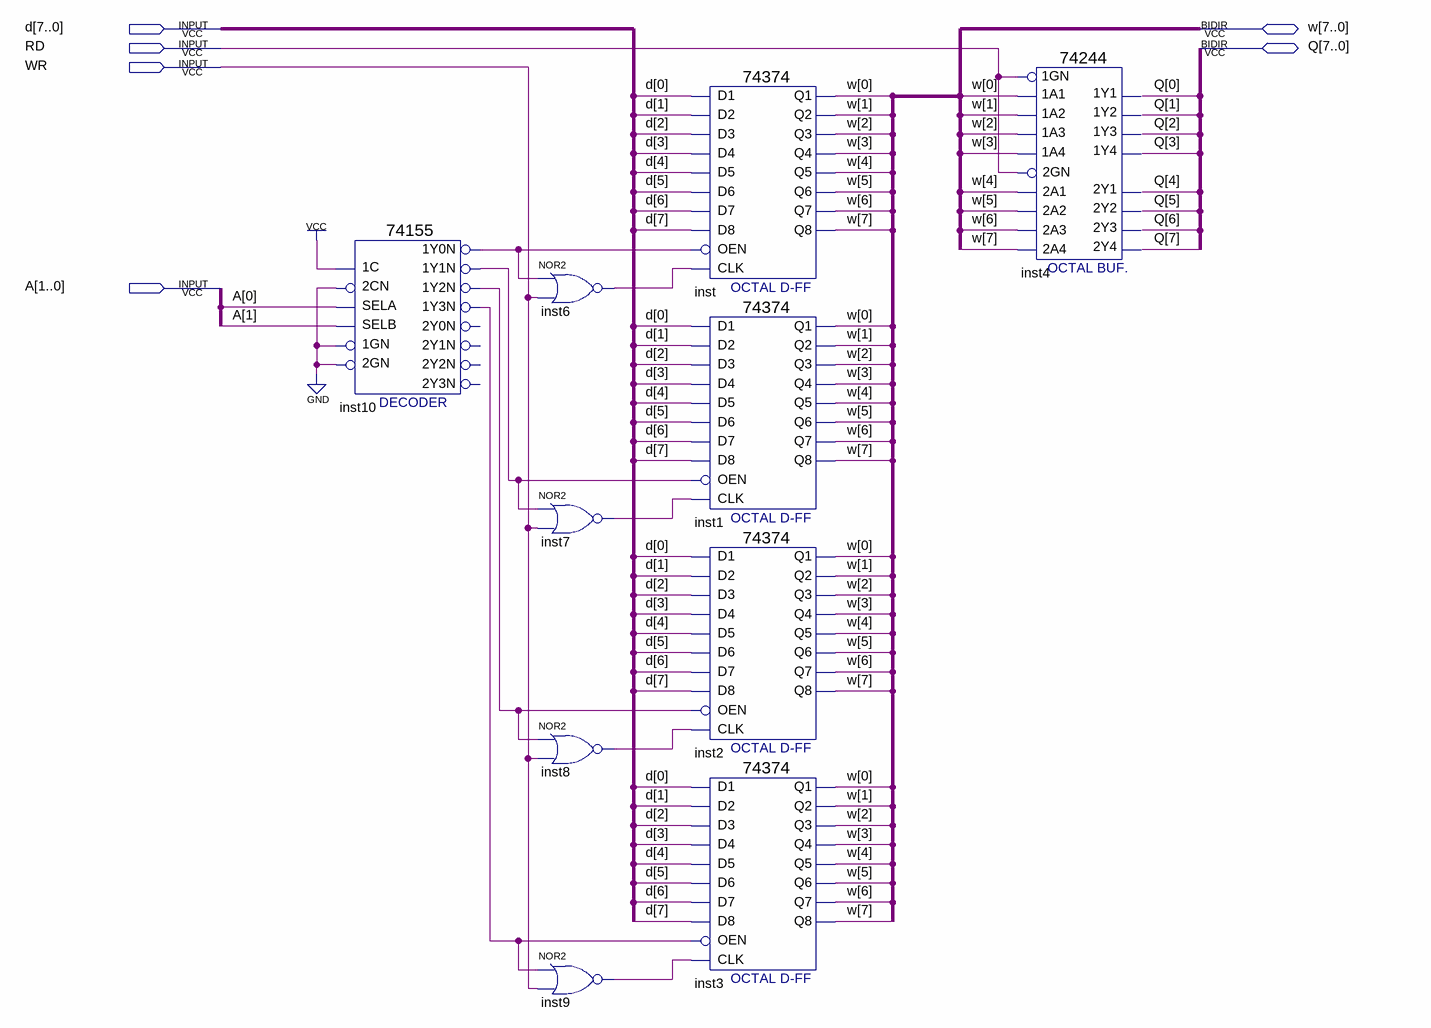
[diagram p0: schematic sheet]
// Quartus schematic mem8b.bdf as structural Verilog: 10 symbols, 6 pins
module mem8b (
  input  [7:0] d,
  input  RD,
  input  WR,
  input  [1:0] A,
  inout  [7:0] w,
  inout  [7:0] Q
);

  wire inst6_out, inst7_out, inst8_out, inst9_out, inst10_1y0n, inst10_1y1n, inst10_1y2n, inst10_1y3n;

  \74155  inst10 (
    .\1C (1'b1), .\2CN (1'b0), .SELB(A[1]), .SELA(A[0]), .\1GN (1'b0), .\2GN (1'b0), .\1Y2N (inst10_1y2n),
    .\1Y1N (inst10_1y1n), .\1Y0N (inst10_1y0n), .\1Y3N (inst10_1y3n));  // open: 2Y1N, 2Y0N, 2Y3N, 2Y2N
  nor inst6 (inst6_out, inst10_1y0n, WR);
  nor inst7 (inst7_out, inst10_1y1n, WR);
  nor inst8 (inst8_out, inst10_1y2n, WR);
  nor inst9 (inst9_out, inst10_1y3n, WR);
  \74374  inst (
    .D1(d[0]), .D2(d[1]), .D3(d[2]), .D4(d[3]), .D6(d[5]), .D5(d[4]), .OEN(inst10_1y0n), .D8(d[7]),
    .D7(d[6]), .CLK(inst6_out), .Q2(w[1]), .Q3(w[2]), .Q5(w[4]), .Q4(w[3]), .Q6(w[5]), .Q7(w[6]), .Q8(w[7]),
    .Q1(w[0]));
  \74374  inst1 (
    .D1(d[0]), .D2(d[1]), .D3(d[2]), .D4(d[3]), .D6(d[5]), .D5(d[4]), .OEN(inst10_1y1n), .D8(d[7]),
    .D7(d[6]), .CLK(inst7_out), .Q2(w[1]), .Q3(w[2]), .Q5(w[4]), .Q4(w[3]), .Q6(w[5]), .Q7(w[6]), .Q8(w[7]),
    .Q1(w[0]));
  \74374  inst2 (
    .D1(d[0]), .D2(d[1]), .D3(d[2]), .D4(d[3]), .D6(d[5]), .D5(d[4]), .OEN(inst10_1y2n), .D8(d[7]),
    .D7(d[6]), .CLK(inst8_out), .Q2(w[1]), .Q3(w[2]), .Q5(w[4]), .Q4(w[3]), .Q6(w[5]), .Q7(w[6]), .Q8(w[7]),
    .Q1(w[0]));
  \74374  inst3 (
    .D1(d[0]), .D2(d[1]), .D3(d[2]), .D4(d[3]), .D6(d[5]), .D5(d[4]), .OEN(inst10_1y3n), .D8(d[7]),
    .D7(d[6]), .CLK(inst9_out), .Q2(w[1]), .Q3(w[2]), .Q5(w[4]), .Q4(w[3]), .Q6(w[5]), .Q7(w[6]), .Q8(w[7]),
    .Q1(w[0]));
  \74244  inst4 (
    .\1A2 (w[1]), .\1A4 (w[3]), .\1A1 (w[0]), .\1A3 (w[2]), .\1GN (RD), .\2A3 (w[6]), .\2GN (RD),
    .\2A1 (w[4]), .\2A4 (w[7]), .\2A2 (w[5]), .\1Y2 (Q[1]), .\1Y4 (Q[3]), .\2Y1 (Q[4]), .\1Y1 (Q[0]),
    .\2Y3 (Q[6]), .\2Y4 (Q[7]), .\1Y3 (Q[2]), .\2Y2 (Q[5]));
endmodule
